# EAGLE schematic vhdci-fx2-gnd (EAGLE 6.4)
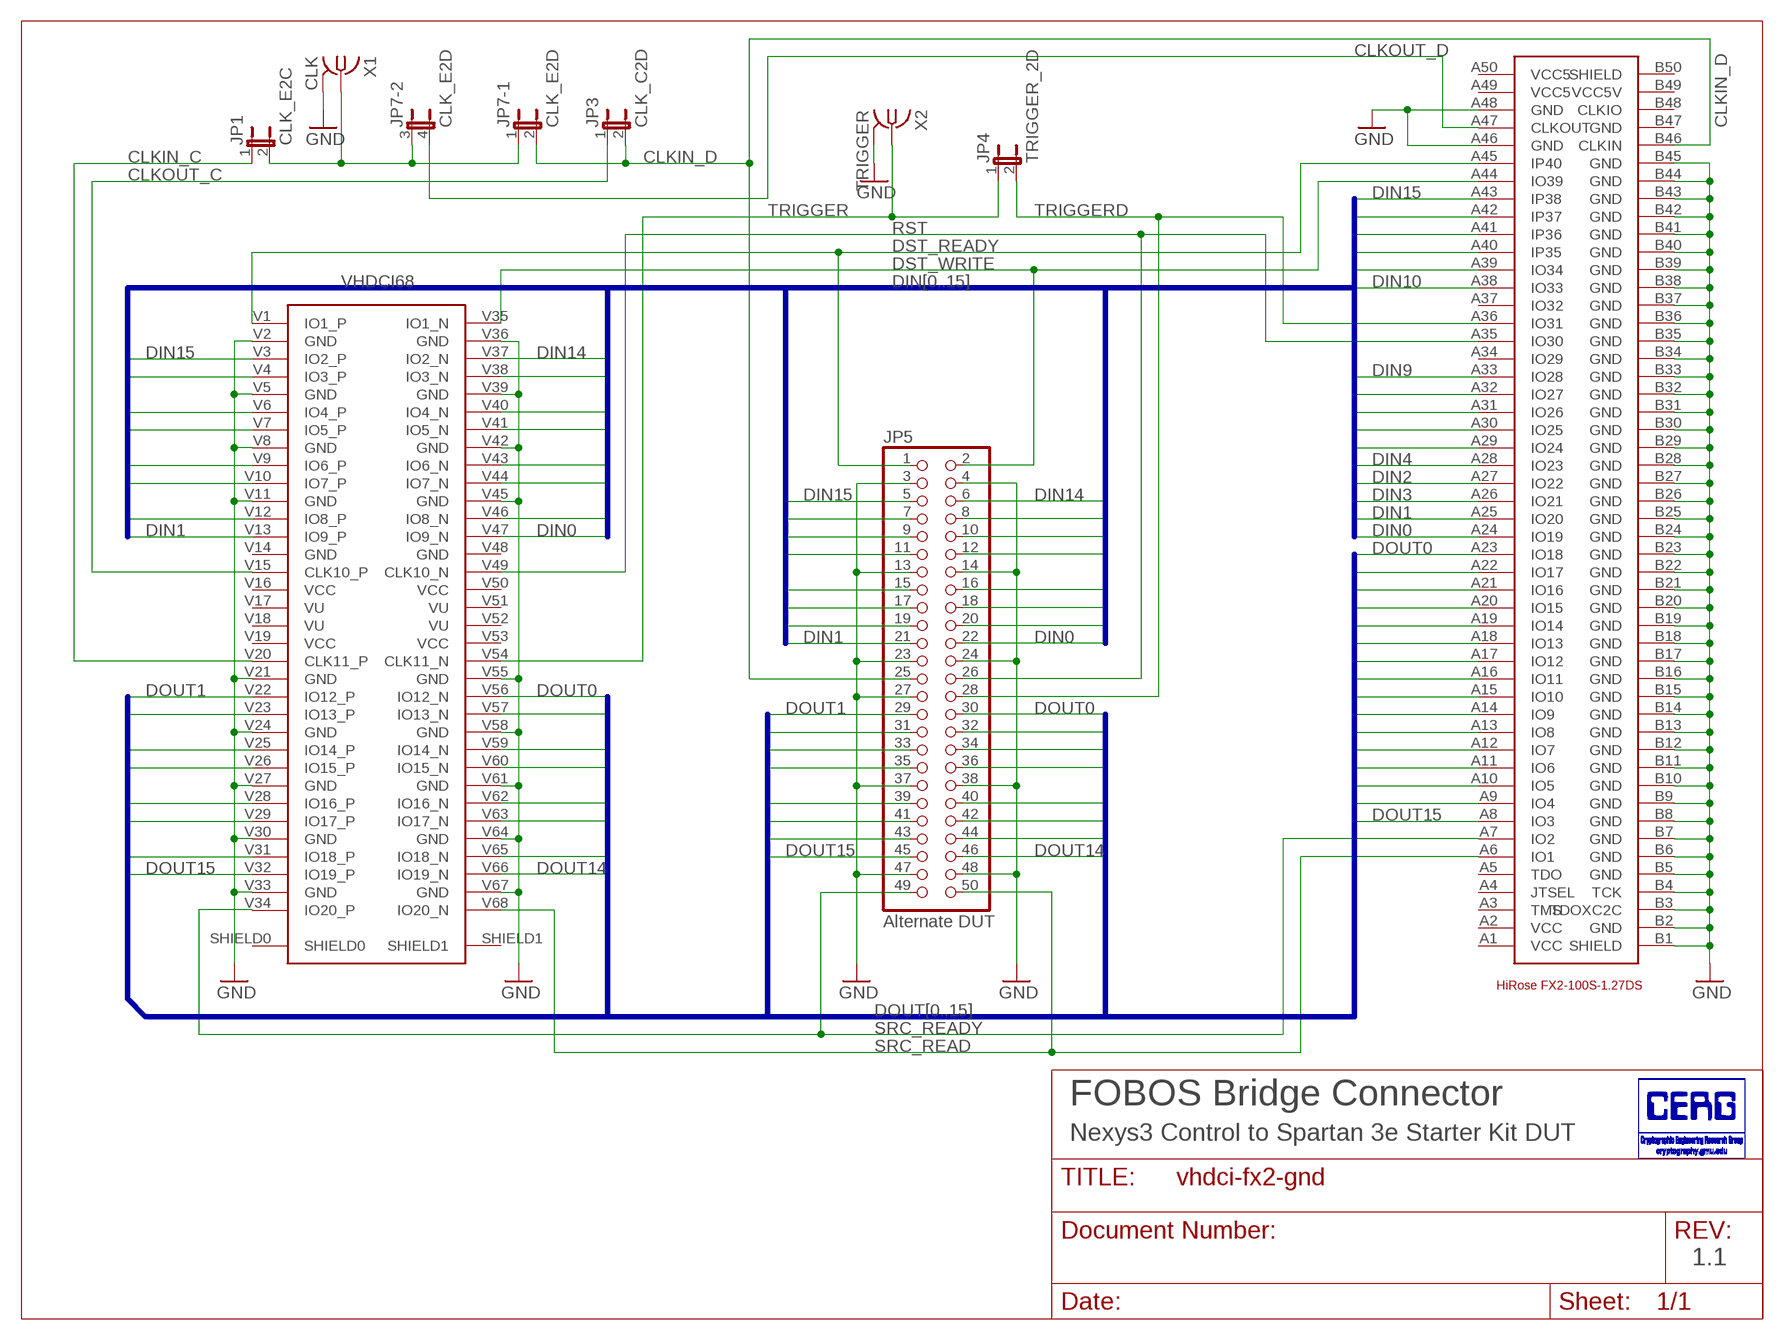
[diagram p0: schematic, sheet 1]

## Parts
DUT  HIROSE-FX2-100S-1.27DS  [HIROSE-FX2-100]
JP1  CLK_E2C  JP1E  [JP1]
JP3  CLK_C2D  JP1E  [JP1]
JP4  TRIGGER_2D  JP1E  [JP1]
JP5  Alternate DUT  PINHD-2X25  [2X25]
JP7  CLK_E2D  JP2QE  [JP2Q]
U$2  VHDCI68  [VHDCI68]
X1  CLK  BU-SMA-V  [BU-SMA-V]
X2  TRIGGER  BU-SMA-V  [BU-SMA-V]

## Nets
CLKIN_C: JP1.1 U$2.V20(CLK11_P)
CLKIN_D: DUT.B46(CLKIN) JP3.2 JP5.25 JP7.2
CLKOUT_C: JP3.1 U$2.V15(CLK10_P)
CLKOUT_D: DUT.A47(CLKOUT) JP7.4
DIN0: DUT.A24(IO19) JP5.22 U$2.V47(IO9_N)
DIN1: DUT.A25(IO20) JP5.21 U$2.V13(IO9_P)
DIN2: DUT.A27(IO22) JP5.20 U$2.V46(IO8_N)
DIN3: DUT.A26(IO21) JP5.19 U$2.V12(IO8_P)
DIN4: DUT.A28(IO23) JP5.18 U$2.V44(IO7_N)
DIN5: DUT.A29(IO24) JP5.17 U$2.V10(IO7_P)
DIN6: DUT.A30(IO25) JP5.16 U$2.V43(IO6_N)
DIN7: DUT.A31(IO26) JP5.15 U$2.V9(IO6_P)
DIN8: DUT.A32(IO27) JP5.12 U$2.V41(IO5_N)
DIN9: DUT.A33(IO28) JP5.11 U$2.V7(IO5_P)
DIN10: DUT.A38(IO33) JP5.10 U$2.V40(IO4_N)
DIN11: DUT.A39(IO34) JP5.9 U$2.V6(IO4_P)
DIN12: DUT.A40(IP35) JP5.8 U$2.V38(IO3_N)
DIN13: DUT.A41(IP36) JP5.7 U$2.V4(IO3_P)
DIN14: DUT.A42(IP37) JP5.6 U$2.V37(IO2_N)
DIN15: DUT.A43(IP38) JP5.5 U$2.V3(IO2_P)
DOUT0: DUT.A23(IO18) JP5.30 U$2.V56(IO12_N)
DOUT1: DUT.A22(IO17) JP5.29 U$2.V22(IO12_P)
DOUT2: DUT.A21(IO16) JP5.32 U$2.V57(IO13_N)
DOUT3: DUT.A20(IO15) JP5.31 U$2.V23(IO13_P)
DOUT4: DUT.A19(IO14) JP5.34 U$2.V59(IO14_N)
DOUT5: DUT.A18(IO13) JP5.33 U$2.V25(IO14_P)
DOUT6: DUT.A17(IO12) JP5.36 U$2.V60(IO15_N)
DOUT7: DUT.A16(IO11) JP5.35 U$2.V26(IO15_P)
DOUT8: DUT.A15(IO10) JP5.40 U$2.V62(IO16_N)
DOUT9: DUT.A14(IO9) JP5.39 U$2.V28(IO16_P)
DOUT10: DUT.A13(IO8) JP5.42 U$2.V63(IO17_N)
DOUT11: DUT.A12(IO7) JP5.41 U$2.V29(IO17_P)
DOUT12: DUT.A11(IO6) JP5.44 U$2.V65(IO18_N)
DOUT13: DUT.A10(IO5) JP5.43 U$2.V31(IO18_P)
DOUT14: DUT.A9(IO4) JP5.46 U$2.V66(IO19_N)
DOUT15: DUT.A8(IO3) JP5.45 U$2.V32(IO19_P)
DST_READY: DUT.A45(IP40) JP5.1 U$2.V1(IO1_P)
DST_WRITE: DUT.A44(IO39) JP5.2 U$2.V35(IO1_N)
GND: DUT.A46(GND) DUT.A48(GND) DUT.B1(SHIELD) DUT.B2(GND) DUT.B3(TDOXC2C) DUT.B4(TCK) DUT.B5(GND) DUT.B6(GND) DUT.B7(GND) DUT.B8(GND) DUT.B9(GND) DUT.B10(GND) DUT.B11(GND) DUT.B12(GND) DUT.B13(GND) DUT.B14(GND) DUT.B15(GND) DUT.B16(GND) DUT.B17(GND) DUT.B18(GND) DUT.B19(GND) DUT.B20(GND) DUT.B21(GND) DUT.B22(GND) DUT.B23(GND) DUT.B24(GND) DUT.B25(GND) DUT.B26(GND) DUT.B27(GND) DUT.B28(GND) DUT.B29(GND) DUT.B30(GND) DUT.B31(GND) DUT.B32(GND) DUT.B33(GND) DUT.B34(GND) DUT.B35(GND) DUT.B36(GND) DUT.B37(GND) DUT.B38(GND) DUT.B39(GND) DUT.B40(GND) DUT.B41(GND) DUT.B42(GND) DUT.B43(GND) DUT.B44(GND) DUT.B45(GND) JP5.3 JP5.4 JP5.13 JP5.14 JP5.23 JP5.24 JP5.27 JP5.37 JP5.38 JP5.47 JP5.48 U$2.V2(GND) U$2.V5(GND) U$2.V8(GND) U$2.V11(GND) U$2.V21(GND) U$2.V24(GND) U$2.V27(GND) U$2.V30(GND) U$2.V33(GND) U$2.V36(GND) U$2.V39(GND) U$2.V42(GND) U$2.V45(GND) U$2.V55(GND) U$2.V58(GND) U$2.V61(GND) U$2.V64(GND) U$2.V67(GND) X1.2(GND) X2.2(GND)
N$3: JP1.2 JP7.1 JP7.3 X1.1
RST: DUT.A35(IO30) JP5.26 U$2.V49(CLK10_N)
SRC_READ: DUT.A6(IO1) JP5.50 U$2.V68(IO20_N)
SRC_READY: DUT.A7(IO2) JP5.49 U$2.V34(IO20_P)
TRIGGER: JP4.1 U$2.V54(CLK11_N) X2.1
TRIGGERD: DUT.A36(IO31) JP4.2 JP5.28
Unconnected: DUT.A3(TMS) DUT.A4(JTSEL) DUT.A5(TDO) DUT.A34(IO29) DUT.A37(IO32) DUT.B48(CLKIO) DUT.B50(SHIELD) U$2.SHIELD0 U$2.SHIELD1 U$2.V14(GND) U$2.V48(GND)

## Buses
DOUT[0..15]
DIN[0..15]

## Notes on the sheet
- FOBOS Bridge Connector
- Nexys3 Control to Spartan 3e Starter Kit DUT
- 1.1

## Power pins joined to a net without a drawn wire
GND: DUT.B47(GND) X1.3(GND) X1.4(GND) X1.5(GND) X2.3(GND) X2.4(GND) X2.5(GND)
VCC: DUT.A1(VCC) DUT.A2(VCC) U$2.V16(VCC) U$2.V19(VCC) U$2.V50(VCC) U$2.V53(VCC)
VCC5: DUT.A49(VCC5) DUT.A50(VCC5)
VCC5V: DUT.B49(VCC5V)
VU: U$2.V17(VU) U$2.V18(VU) U$2.V51(VU) U$2.V52(VU)

## Library data of the parts
DUT = hirose-fx2-100:HIROSE-FX2-100S-1.27DS
JP1 JP3 JP4 = jumper:JP1E: JUMPER
JP5 = pinhead:PINHD-2X25: PIN HEADER
JP7 = jumper:JP2QE: JUMPER
U$2 = tw:VHDCI68: Nexys 3 VHDCI 68pin 0.8mm pitch
X1 X2 = con-coax:BU-SMA-V: FEMALE SMA CONNECTOR Radiall distributor RS 112-3794; OC_FARNELL: unknown; OC_NEWARK: unknown